# Altium schematic sheet TCAN1146_PWR_MGMT.SchDoc
size C; SheetNumber: 3; SheetTotal: 15
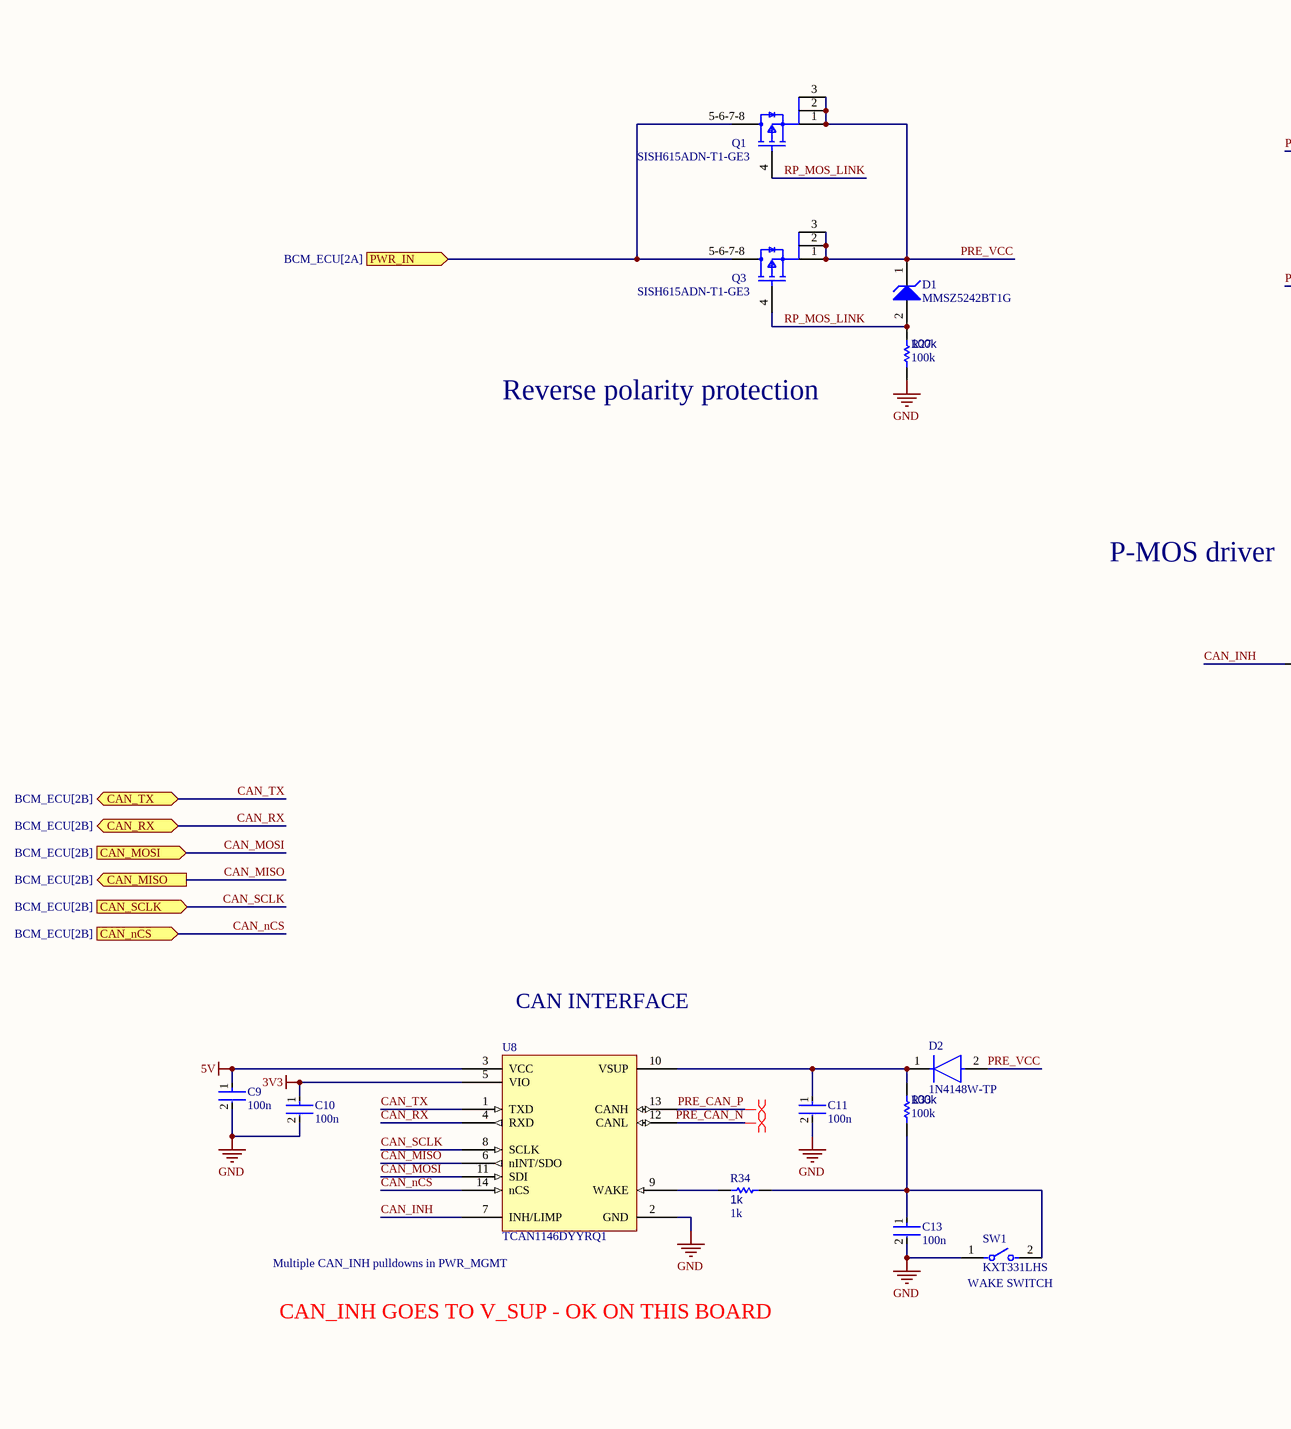
[diagram p0: TCAN1146_PWR_MGMT.SchDoc, left]
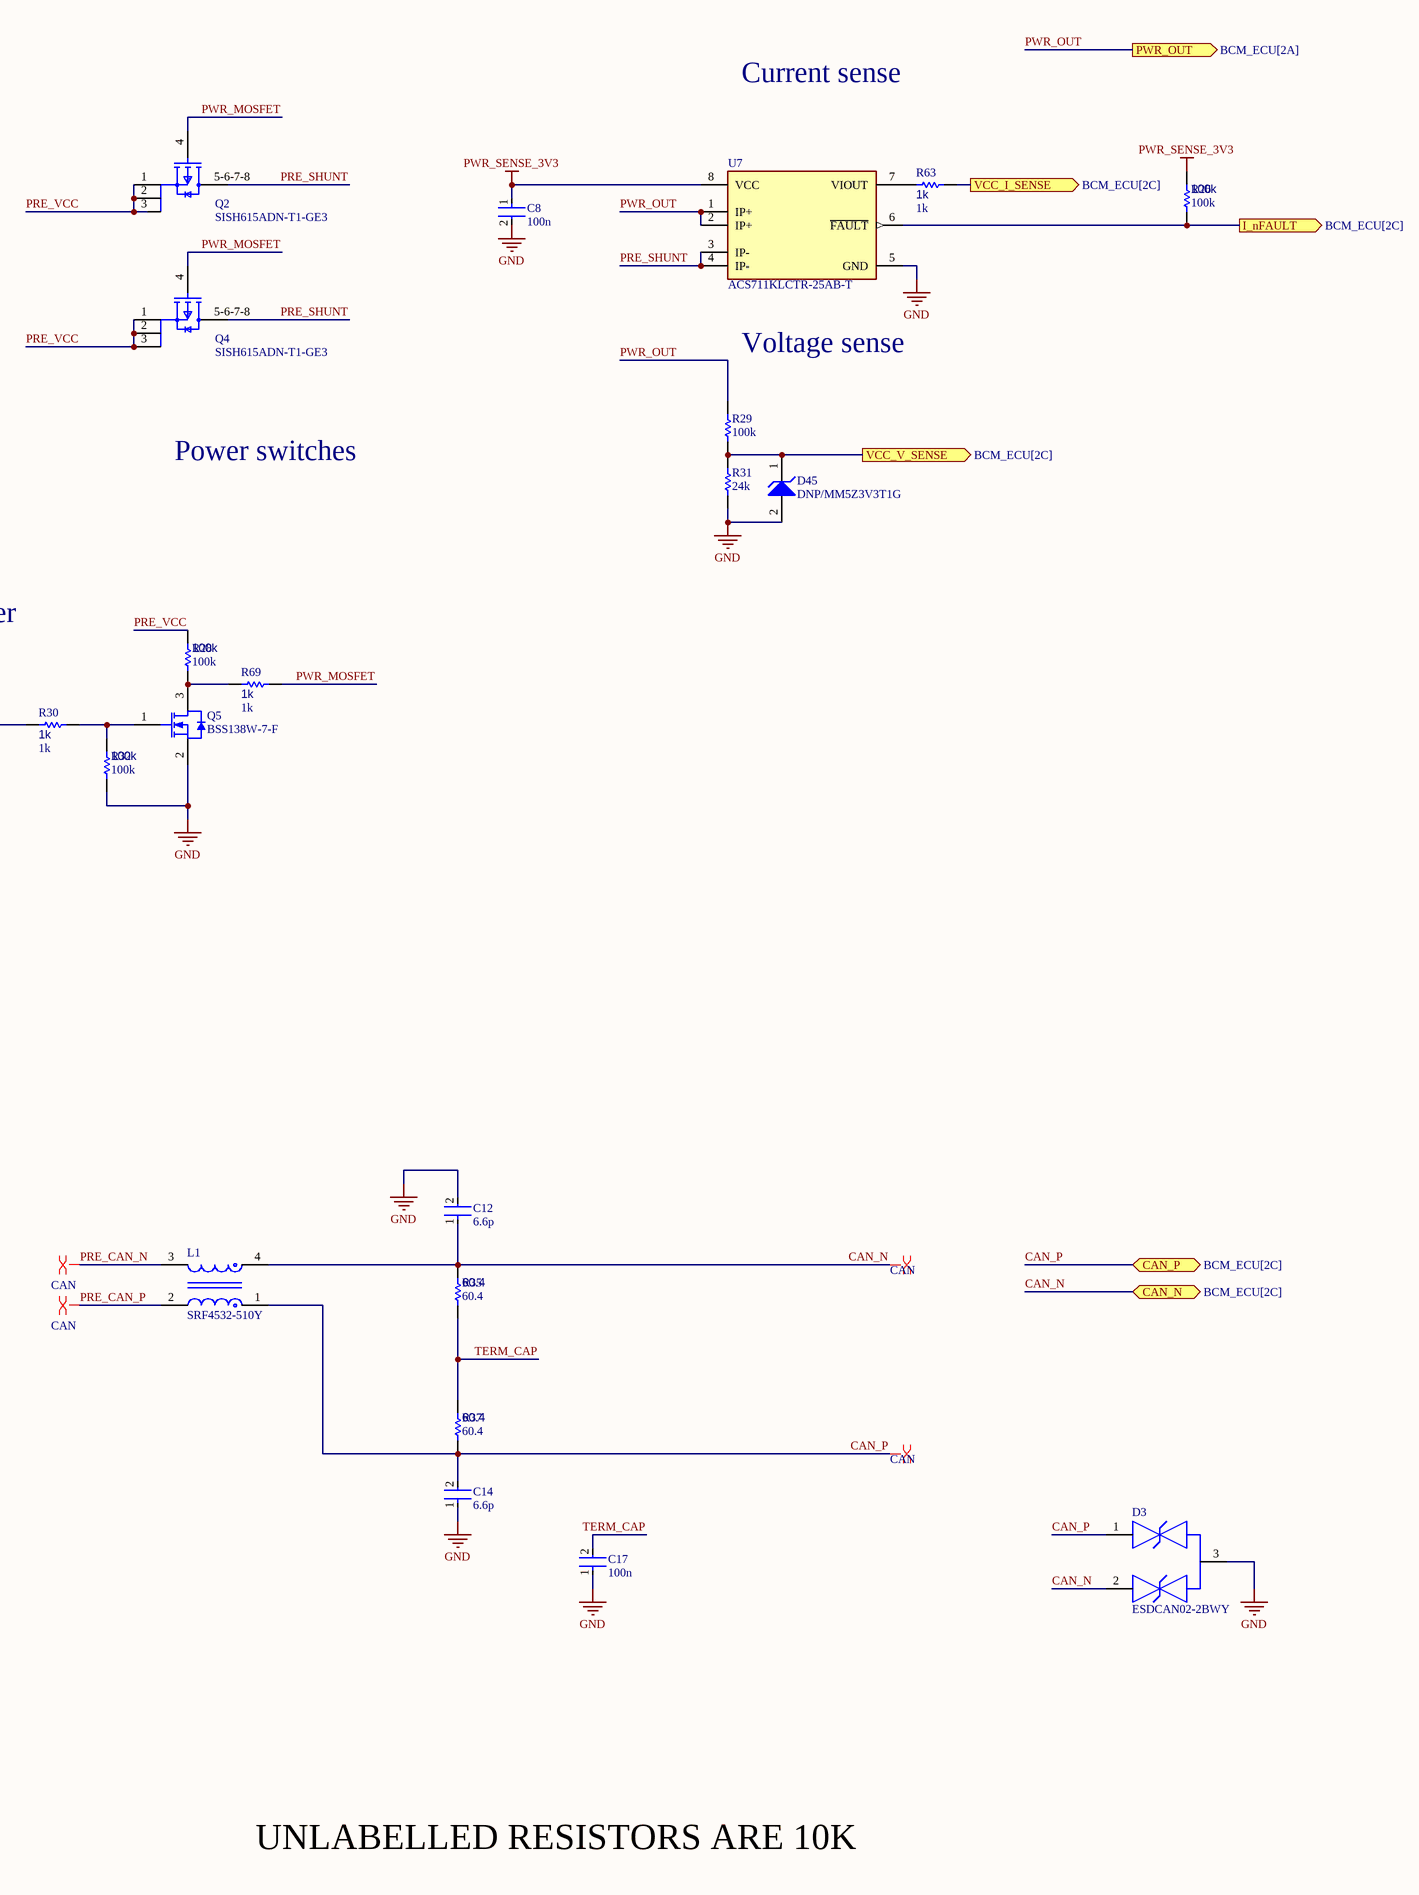
[diagram p1: TCAN1146_PWR_MGMT.SchDoc, right]

## Parts
C8  100n  [FP-0402-L_1_0_0_05-W_0_5-IPC_A]
C9  100n  [FP-0402-L_1_0_0_05-W_0_5-IPC_A]
C10  100n  [FP-0402-L_1_0_0_05-W_0_5-IPC_A]
C11  100n  [FP-0402-L_1_0_0_05-W_0_5-IPC_A]
C12  6.6p  [FP-0402-L_1_0_0_05-W_0_5-IPC_A]
C13  100n  [FP-0402-L_1_0_0_05-W_0_5-IPC_A]
C14  6.6p  [FP-0402-L_1_0_0_05-W_0_5-IPC_A]
C17  100n  [FP-0402-L_1_0_0_05-W_0_5-IPC_A]
D1  MMSZ5242BT1G  [ONSC-SOD-123-2-425-04_V]
D2  1N4148W-TP  [FP-SOD-123-IPC_A]
D3  ESDCAN02-2BWY  [FP-SOT323-3L-MFG]
D45  DNP/MM5Z3V3T1G  [ONSC-SOD-523-2-502-01_V]
L1  SRF4532-510Y  [FP-SRF4532-MFG]
Q1  SISH615ADN-T1-GE3  [SISH615ADN-T1-GE3-Footprint-1]
Q2  SISH615ADN-T1-GE3  [SISH615ADN-T1-GE3-Footprint-1]
Q3  SISH615ADN-T1-GE3  [SISH615ADN-T1-GE3-Footprint-1]
Q4  SISH615ADN-T1-GE3  [SISH615ADN-T1-GE3-Footprint-1]
Q5  BSS138W-7-F  [DIOD-SOT323-3_V]
R26  100k  [R0603B]
R27  100k  [R0603B]
R28  100k  [R0603B]
R29  100k  [R0603B]
R30  1k  [R0603B]
R31  24k  [R0603B]
R32  100k  [R0603B]
R33  100k  [R0603B]
R34  1k  [R0603B]
R35  60.4  [R0603B]
R37  60.4  [R0603B]
R63  1k  [R0603B]
R69  1k  [R0603B]
SW1  KXT331LHS  [FP-KXT331LHS-MFG]
U7  ACS711KLCTR-25AB-T  [FP-LC-8-IPC_A]
U8  TCAN1146DYYRQ1  [TCAN1146DYYRQ1-Footprint-1]

## Ports
CAN_MISO (out, see BCM_ECU[2B]), CAN_MOSI (in, see BCM_ECU[2B]), CAN_N (bidir, see BCM_ECU[2C]), CAN_nCS (in, see BCM_ECU[2B]), CAN_P (bidir, see BCM_ECU[2C]), CAN_RX (bidir, see BCM_ECU[2B]), CAN_SCLK (in, see BCM_ECU[2B]), CAN_TX (bidir, see BCM_ECU[2B]), I_nFAULT (out, see BCM_ECU[2C]), PWR_IN (in, see BCM_ECU[2A]), PWR_OUT (out, see BCM_ECU[2A]), VCC_I_SENSE (out, see BCM_ECU[2C]), VCC_V_SENSE (out, see BCM_ECU[2C])

## Nets
3V3: C10.1 U8.5(VIO)
5V: C9.1 U8.3(VCC)
GND: C8.2 C9.2 C10.2 C11.2 C12.2 C13.2 C14.1 C17.1 D3.3 D45.2(A) Q5.2(S) R27.1 R31.1 R32.1 SW1.1 U7.5(GND) U8.2(GND)
PWR_SENSE_3V3: C8.1 R26.2 U7.8(VCC)
CAN_INH: R30.1 U8.7(INH/LIMP)
CAN_MISO: U8.6(nINT/SDO) ; port CAN_MISO
CAN_MOSI: U8.11(SDI) ; port CAN_MOSI
CAN_N: C12.1 D3.2 L1.4 R35.2 ; port CAN_N
CAN_nCS: U8.14(nCS) ; port CAN_nCS
CAN_P: C14.2 D3.1 L1.1 R37.1 ; port CAN_P
CAN_RX: U8.4(RXD) ; port CAN_RX
CAN_SCLK: U8.8(SCLK) ; port CAN_SCLK
CAN_TX: U8.1(TXD) ; port CAN_TX
I_nFAULT: R26.1 U7.6(~{FAULT}) ; port I_nFAULT
PRE_CAN_N: L1.3 U8.12(CANL)
PRE_CAN_P: L1.2 U8.13(CANH)
PRE_SHUNT: Q2.5-6-7-8(D) Q4.5-6-7-8(D) U7.3(IP-) U7.4(IP-)
PRE_VCC: D1.1(K) D2.2(A) Q1.1(S) Q1.2(S) Q1.3(S) Q2.1(S) Q2.2(S) Q2.3(S) Q3.1(S) Q3.2(S) Q3.3(S) Q4.1(S) Q4.2(S) Q4.3(S) R28.2
PWR_IN: Q1.5-6-7-8(D) Q3.5-6-7-8(D) ; port PWR_IN
PWR_MOSFET: Q2.4(G) Q4.4(G) R69.2
PWR_OUT: R29.2 U7.1(IP+) U7.2(IP+) ; port PWR_OUT
RP_MOS_LINK: D1.2(A) Q1.4(G) Q3.4(G) R27.2
TERM_CAP: C17.2 R35.1 R37.2
VCC_I_SENSE: R63.1 ; port VCC_I_SENSE
VCC_V_SENSE: D45.1(K) R29.1 R31.2 ; port VCC_V_SENSE
NetC11_1: C11.1 D2.1(C) R33.2 U8.10(VSUP)
NetC13_1: C13.1 R33.1 R34.2 SW1.2
NetQ5_1: Q5.1(G) R30.2 R32.2
NetQ5_3: Q5.3(D) R28.1 R69.1
NetR34_1: R34.1 U8.9(WAKE)
NetR63_2: R63.2 U7.7(VIOUT)

## Layout directives
differential pair: PRE_CAN_N, PRE_CAN_P
differential pair; differential pair class CAN: CAN_N, CAN_P, PRE_CAN_N, PRE_CAN_P

## Notes on the sheet
- Current sense
- Voltage sense
- (near R27) Reverse polarity protection
- Power switches
- P-MOS driver
- CAN INTERFACE
- (near U8) Multiple CAN_INH pulldowns in PWR_MGMT
- (near SW1) WAKE SWITCH
- CAN_INH GOES TO V_SUP - OK ON THIS BOARD
- UNLABELLED RESISTORS ARE 10K

## Library data of the parts
C8-C14 C17 = CMP-001-00058-1: LARGE PADS, 0402 CAP, CHANGE COMMENT TO MATCH REAL P/N; Capacitor Type: Ceramic; Min Operating Temperature: -55°C; Mounting Technology: Surface Mount; Pins: 2; Case/Package: 0402; RoHS Compliant: Yes; Max Operating Temperature: 85°C
D1 = CMP-1060-00565-1: Zener Voltage Regulator, 500 mW, 2-Pin SOD-123, Pb-Free, Tape and Reel; Manufacturer: On Semiconductor; P Max (W): 0.5; VZ Typ (V): 12; PartNumber: MMSZ5242BT1G; PackageReference: SOD-123-2-425-04; ComponentLink3URL: http://www.onsemi.com/pub_link/Collateral/425-04.PDF; Mounting Technology: Surface Mount; ComponentLink2Description: Datasheet; ComponentLink1URL: http://www.onsemi.com/; ComponentLink3Description: Package Specification; PackageDescription: 2-Pin SOD, Body 1.6 x 2.69 mm; PackageVersion: Rev. G, 10/2009; ComponentLink1Description: Manufacturer URL; RoHS: Pb-Free; ComponentLink2URL: http://www.onsemi.com/pub_link/Collateral/MMSZ5221BT1-D.PDF; Packing: Tape and Reel; DatasheetVersion: Rev. 12
D2 = CMP-2000-04993-2: DIODE GEN PURP 100V 150MA SOD123; Max Reverse Leakage Current: 5uA; Max Surge Current: 2A; Reverse Recovery Time: 4ns; Polarity: Standard; Capacitance: 4pF; Max Forward Surge Current (Ifsm): 1A; Element Configuration: Single; Power Dissipation: 400mW; Forward Voltage: 1V; Radiation Hardening: No; Lead Free: Lead Free; Max Reverse Voltage (DC): 100V; Current Rating: 150mA; Forward Current: 150mA; Packaging: Tape and Reel; Number of Pins: 2; Package Quantity: 3000; Max Operating Temperature: 150°C; Min Operating Temperature: -65°C; Average Rectified Current: 150mA; Recovery Time: 4ns; Output Current: 150mA; Peak Non-Repetitive Surge Current: 2A; Width: 1.8mm; Voltage Rating (DC): 100V; Height: 1.2mm; Max Repetitive Reverse Voltage (Vrrm): 100V; Mount: Surface Mount; Length: 2.85mm
D3 = CMP-12225-000055-1: TVS DIODE 26.5V 44V SOT323-3; Manufacturer: STMicroelectronics; Value: 3pF; Direction: Bidirectional; Breakdown Voltage: 28.5V; Automotive Grade: Grade 0; Standoff Height: 0mm; Peak Pulse Power: 170W; Peak Pulse Current: 3A; Number Of Channels: 2; Max Junction Temp: +175°C; Mouser Description: TVS Diodes / ESD Suppressors Automotive dual-line Transil, Transient voltage suppressor (TVS) for CAN bus; Height: 1.1mm; Category: Diode; Reverse Standoff Voltage: 26.5V; Device Class L1: Circuit Protection; Temperature: -55°C to +175°C; RoHS: TRUE; ComponentLink2URL: https://www.st.com/resource/en/datasheet/esdcan02-2bwy.pdf; Device Class L3: unset; Device Class L2: TVS Diodes; Temperature Range High: +175°C; Octopart: https://octopart.com/esdcan02-2bwy-stmicroelectronics-58631133; Ipc Land Pattern Name: SOT65P210X95-3; Temperature Range Low: -55°C; Capacitance: 3pF; Digikey Description: TVS DIODE 26.5V 44V SOT323-3; Automotive: Yes; ComponentLink2Description: Datasheet; Clamping Voltage: 44V; Manufacturer Part Number: ESDCAN02-2BWY; Lead Free: Yes; Package: SOT323-3L
D45 = CMP-1060-00750-1: Zener Voltage Regulator, 500 mW, 2-Pin SOD-523, Pb-Free, Tape and Reel; Manufacturer: On Semiconductor; P Max (W): 0.5; VZ Typ (V): 3.3; RoHS: Pb-Free; ComponentLink2Description: Datasheet; PackageReference: SOD-523-2-502-01; DatasheetVersion: Rev. 10; ComponentLink1Description: Manufacturer URL; PackageVersion: Rev. E, 09/2010; ComponentLink3URL: http://www.onsemi.com/pub_link/Collateral/502-01.PDF; ComponentLink2URL: http://www.onsemi.cn/pub_link/Collateral/MM5Z2V4T1-D.PDF; Mounting Technology: Surface Mount; PartNumber: MM5Z3V3T1G; Packing: Tape and Reel; PackageDescription: 2-Pin SOD, Body 1.2 x 0.8 mm; ComponentLink1URL: http://www.onsemi.com/; ComponentLink3Description: Package Specification
L1 = CMP-07251-000006-1: CMC 51UH 200MA 2LN 2KOHM SMD; Element Configuration: Dual; Number of Lines: 2; Core Material: Ferrite; Impedance: 2kR; Test Frequency: 100kHz; Voltage Rating (DC): 50V; Insulation Resistance: 10MR; Material: Steel; Tolerance: 50%; DC Resistance (DCR): 3.5R; RoHS Compliant: Yes; Mount: Surface Mount; REACH SVHC: No SVHC; Termination: SMD/SMT; DC Current: 200mA; Current: 200mA; Lead Free: Lead Free; Contact Plating: Tin; Length: 4.5mm; Max DC Current: 200mA; Width: 0.126inch; Case/Package: 4532; Packaging: Tape and Reel; Package Quantity: 1; Min Operating Temperature: -40°C; Depth: 3.4mm; Series: SRF4532; Max Operating Temperature: 125°C; Current Rating: 200mA; Self Resonant Frequency: 100kHz; Height: 0.118inch; Inductance: 51uH; Resistance: 2kR
Q1-Q4 = CMP-013-00018-2: Trans MOSFET P-CH 20V 22.1A 8-Pin PowerPAK 1212 EP T/R; Source: SISH615ADN-T1-GE3.SchLib; Design Item ID: CMP-013-00036-4; Component Type: Standard; Pins: 5
Q5 = CMP-2000-05968-1: N-Channel Enhancement Mode Mosfet, 50 V, 200 mA, -55 to 150 degC, 6-Pin SOT-323, RoHS, Tape and Reel; Typical Turn-Off Delay Time: 20ns; Number of Channels: 1Channel; Type: EnhancementModeFieldEffectTransistor; Brand: DiodesIncorporated; Vds - Drain-Source Breakdown Voltage: 75V; Vgs - Gate-Source Voltage: 20V; Rds On - Drain-Source Resistance: 1.4Ohms; Transistor Type: 1N-Channel; Configuration: Single; Unit Weight: 0.000212oz; Pd - Power Dissipation: 200mW; Id - Continuous Drain Current: 200mA; Forward Transconductance - Min: 0.1S; Manufacturer URL: http://www.diodes.com/; Series: BSS138; Package Description: 3-Pin Small Outline Transistor, Body 2 x 1.25 mm, Pitch 0.65 mm; Mounting Technology: SurfaceMount; Product Category: MOSFET; RoHS: True; Maximum Operating Temperature: +150C; Height: 1mm; Length: 2.2mm; Technology: Si; Width: 1.35mm; Datasheet URL: http://www.diodes.com/_files/datasheets/ds30206.pdf; Manufacturer: DiodesIncorporated; Package / Case: SOT-323-3; Typical Turn-On Delay Time: 20ns; Transistor Polarity: N-Channel; Factory Pack Quantity: 3000; Packaging: Reel; Product: MOSFETSmallSignal; Datasheet Version: Rev. 11-2, 09/2013; Package Reference: SOT323; Minimum Operating Temperature: -55C; Mounting Style: SMD/SMT; Channel Mode: Enhancement
R26-R35 R37 R63 R69 = CMP-009-00002-14: Resistor
  R26-R29 R32 R33: Value: 100k
  R30 R34 R63 R69: Value: 1k
  R31: Value: 24k
  R35 R37: Value: 60.4
SW1 = CMP-10040-000029-1: SWITCH TACTILE SPST-NO 0.02A 15V; Operating Force: 240gf; Switch Travel: 0.13mm; Illumination Type: Non-Illuminated; Throw Configuration: SPST; Number of Ports: 1; Current Rating: 5A; Mechanical Life: 500000Cycles; Switch Function: Off-Mom; Connector Type: USB; Actuator Type: Standard; Gender: Receptacle; Number of Contacts: 24; Contact Plating: Gold; Insulation Color: Black; Min Operating Temperature: -40°C; Packaging: Tape and Reel; Flammability Rating: UL94 V-0; Max Operating Temperature: 85°C; Termination: Solder; Mount: Surface Mount
U7 = CMP-1557-00015-2: SENSOR CURRENT HALL 25A AC/DC; Bandwidth: 100kHz; Min Supply Voltage: 3V; Polarity: Bidirectional; Max Supply Voltage: 5.5V; Max Supply Current: 5.5mA; Number of Channels: 1; Quiescent Current: 4mA; Sensitivity: 55mV/A; Accuracy: 4%; Linearity: 1%; Operating Supply Voltage: 3.3V; Response Time: 4.6us; Case/Package: SOIC; Min Operating Temperature: -40°C; RoHS Compliant: Yes; Length: 4.9mm; Package Quantity: 1; Number of Pins: 8; Width: 3.9mm; REACH SVHC: No SVHC; -3db Bandwidth: 100kHz; Series: -; Packaging: Tape and Reel; Max Operating Temperature: 125°C; Current Sensing: 25A; Height: 1.5mm; Frequency: 100kHz
U8 = CMP-318-000000-2: Automotive CAN FD transceiver with watchdog, bus diagnostics and partial networking via sele 14-SOT-23-THIN -40 to 150; Component Type: Standard; Design Item ID: CMP-015-00012-2; Pin Count: 14; Source: TCAN1146DYYRQ1.SchLib